# Altium schematic sheet uSD Card Interface.SchDoc: uSD Card Connection Port
size A4
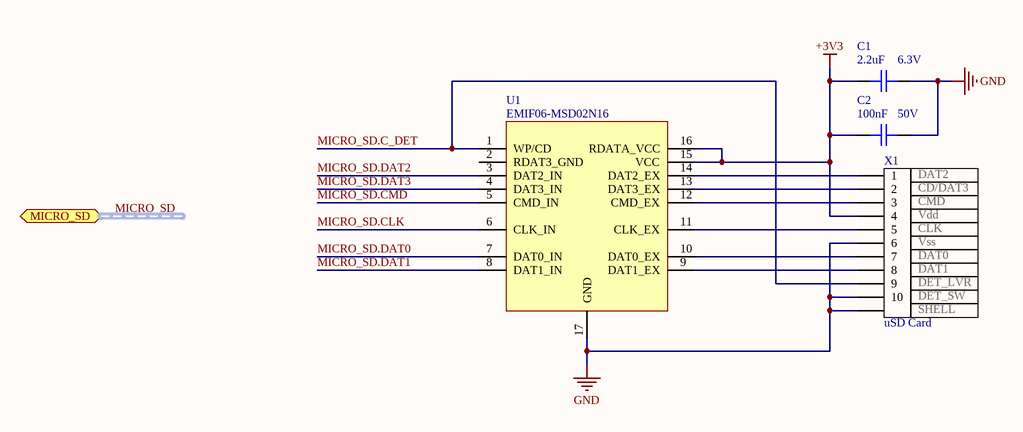
[diagram p0: uSD Card Interface.SchDoc]

## Parts
C1  Capacitance: 2.2uF  Voltage: 6.3V  [C0402]  (hidden comment: CAP CER 2.2UF 6.3V X5R 0402)
C2  Capacitance: 100nF  Voltage: 50V  [C0402]  (hidden comment: CAP CER 0.1UF 50V X7R 0402)
U1  EMIF06-MSD02N16  [QFN 3.5x1.2-16L]
X1  uSD Card  pin_1: DAT2  pin_2: CD/DAT3  pin_3: CMD  pin_4: Vdd  pin_5: CLK  pin_6: Vss  pin_7: DAT0  pin_8: DAT1  pin_9: DET_LVR  pin_10: DET_SW  pin_0: SHELL  [5025700893]

## Ports
MICRO_SD (harness MICRO_SD)

## Nets
+3V3: C1.2 C2.2 U1.15(VCC) U1.16(RDATA_VCC) X1.4
GND: C1.1 C2.1 U1.17(GND) X1.0 X1.6 X1.10
MICRO_SD.C_DET: U1.1(WP/CD) X1.9
MICRO_SD.CLK: U1.6(CLK_IN)
MICRO_SD.CMD: U1.5(CMD_IN)
MICRO_SD.DAT0: U1.7(DAT0_IN)
MICRO_SD.DAT1: U1.8(DAT1_IN)
MICRO_SD.DAT2: U1.3(DAT2_IN)
MICRO_SD.DAT3: U1.4(DAT3_IN)
NetU1_9: U1.9(DAT1_EX) X1.8
NetU1_10: U1.10(DAT0_EX) X1.7
NetU1_11: U1.11(CLK_EX) X1.5
NetU1_12: U1.12(CMD_EX) X1.3
NetU1_13: U1.13(DAT3_EX) X1.2
NetU1_14: U1.14(DAT2_EX) X1.1

Not connected (* = marked no-connect by the designer): U1 2(RDAT3_GND)

## Buses and harness runs
harness MICRO_SD = port MICRO_SD

## Notes on the sheet
- Title
- Size:
- Date:
- A4
- Number:
- Time:
- Revision:
- Sheet
- of
- File:

## Library data of the parts
C1 = CAP CER 2.2UF 6.3V X5R 0402: 2.2µF ±20% 6.3V Ceramic Capacitor X5R 0402 (1005 Metric); Manufacturer: Murata; Manufacturer Part Number: GRM155R60J225ME15D; Supplier 1: Digi-Key; Stock 1: 4444410; Pricing 1: 1=0.29, 10=0.199, 100=0.1009, 500=0.0691, 1000=0.0611, 2500=0.0584, 5000=0.0531 (USD); Mount: Surface Mount; Case/Package: 0402; Case Code (Metric): 1005; Material: Ceramic; Min Operating Temperature: -55°C; Max Operating Temperature: 85°C; Tolerance: 20%; Dielectric: X5R; Packaging: Tape and Reel; Package Quantity: 10000; Voltage Rating: 6.3V; Voltage Rating (DC): 6.3V; Termination: SMD/SMT; Length: 1mm; Height: 0.5mm; Width: 0.02inch; Thickness: 0.022inch; Depth: 0.5mm; Radiation Hardening: No; REACH SVHC: No SVHC; Lead Free: Lead Free; ComponentLink1URL: https://www.murata.com/~/media/webrenewal/support/library/catalog/products/capacitor/mlcc/c02e.ashx?la=en-us&src-supplier=Digi-Key; ComponentLink1Description: https://www.murata.com/~/media/webrenewal/support/library/catalog/products/capacitor/mlcc/c02e.ashx?la=en-us&src-supplier=Digi-Key; ComponentLink2URL: http://www.murata.com/~/media/webrenewal/support/library/catalog/products/capacitor/mlcc/c02e.ashx?src-supplier=Avnet; ComponentLink2Description: http://www.murata.com/~/media/webrenewal/support/library/catalog/products/capacitor/mlcc/c02e.ashx?src-supplier=Avnet; ComponentLink3URL: http://www.farnell.com/datasheets/2047859.pdf?src-supplier=Element14; ComponentLink3Description: http://www.farnell.com/datasheets/2047859.pdf?src-supplier=Element14; ComponentLink4URL: https://produktinfo.conrad.com/datenblaetter/450000-474999/450128-da-01-de-VS_KONDENS_GRM155_R60J_225ME15D.pdf?src-supplier=Conrad; ComponentLink4Description: https://produktinfo.conrad.com/datenblaetter/450000-474999/450128-da-01-de-VS_KONDENS_GRM155_R60J_225ME15D.pdf?src-supplier=Conrad; Supplier Part Number 1: 490-4519-1-ND; Case Code (Imperial): 0402
C2 = CAP CER 0.1UF 50V X7R 0402: 0.1µF ±10% 50V Ceramic Capacitor X7R 0402 (1005 Metric); Manufacturer: TDK; Manufacturer Part Number: CGA2B3X7R1H104K050BB; Supplier 1: Digi-Key; Stock 1: 2925303; Pricing 1: 1=0.17, 10=0.118, 50=0.0668, 100=0.0553, 500=0.0388, 1000=0.0321, 2500=0.0299, 5000=0.0273 (USD); Mount: Surface Mount; Case/Package: 0402; Weight: 2.3E-05oz; Case Code (Metric): 1005; Case Code (Imperial): 0402; Min Operating Temperature: -55°C; Max Operating Temperature: 125°C; Voltage Rating: 50V; Tolerance: 10%; Packaging: Tape and Reel; Package Quantity: 1; Voltage Rating (DC): 50V; Dielectric: X7R; Termination: SMD/SMT; Composition: Ceramic; Length: 1mm; Height: 0.5mm; Width: 0.02inch; Thickness: 0.022inch; Depth: 0.5mm; Ratings: AEC-Q200; REACH SVHC: No SVHC; Lead Free: Lead Free; ComponentLink1URL: http://product.tdk.com/capacitor/mlcc/en/documents/mlccspec_automotive_general_midvoltage_en.pdf?src-supplier=Future+Electronics; ComponentLink1Description: http://product.tdk.com/capacitor/mlcc/en/documents/mlccspec_automotive_general_midvoltage_en.pdf?src-supplier=Future+Electronics; ComponentLink2URL: http://www.farnell.com/datasheets/1807242.pdf?src-supplier=Element14; ComponentLink2Description: http://www.farnell.com/datasheets/1807242.pdf?src-supplier=Element14; ComponentLink3URL: http://www.mouser.com/ds/2/400/lcc_automotive_general_en-843974.pdf?src-supplier=Mouser; ComponentLink3Description: http://www.mouser.com/ds/2/400/lcc_automotive_general_en-843974.pdf?src-supplier=Mouser; ComponentLink4URL: http://www.farnell.com/datasheets/1936565.pdf?src-supplier=Element14; ComponentLink4Description: http://www.farnell.com/datasheets/1936565.pdf?src-supplier=Element14; ComponentLink5URL: http://www.farnell.com/datasheets/1735392.pdf?src-supplier=Element14; ComponentLink5Description: http://www.farnell.com/datasheets/1735392.pdf?src-supplier=Element14; Supplier Part Number 1: 445-6899-1-ND
U1 = FILTER RC(PI) 45 OHM/20PF SMD: RC (Pi) EMI Filter 2nd Order Low Pass 6 Channel R = 45Ohms, C = 20pF (Total)  16-UFDFN Exposed Pad; Manufacturer: STMicroelectronics; Number of Channels: 6; ESD Protection: Yes; Breakdown Voltage: 8V; Supplier 1: Digi-Key; Manufacturer Part Number: EMIF06-MSD02N16; Stock 1: 3881; Pricing 1: 1=0.95, 10=0.904, 25=0.8752, 50=0.7148, 100=0.6418, 250=0.5834, 500=0.5543, 1000=0.4959 (USD); Mount: Surface Mount; Case/Package: QFN; Number of Pins: 16; Contact Plating: Gold; Min Operating Temperature: -30°C; Max Operating Temperature: 85°C; Termination: Flat; Packaging: Tape and Reel; Package Quantity: 1; Capacitance: 20pF; Max Breakdown Voltage: 8V; Length: 3.55mm; Height: 0.022inch; Width: 0.047inch; Depth: 1.25mm; Radiation Hardening: No; Lead Free: Lead Free; REACH SVHC: No SVHC; ComponentLink1URL: http://www.st.com/content/ccc/resource/technical/document/datasheet/a7/86/d3/98/2c/7f/4b/d2/CD00217829.pdf/files/CD00217829.pdf/jcr:content/translations/en.CD00217829.pdf?src-supplier=Digi-Key; ComponentLink1Description: http://www.st.com/content/ccc/resource/technical/document/datasheet/a7/86/d3/98/2c/7f/4b/d2/CD00217829.pdf/files/CD00217829.pdf/jcr:content/translations/en.CD00217829.pdf?src-supplier=Digi-Key; ComponentLink2URL: https://www.verical.com/server-webapp/html/getDatasheet?partID=558558&src-supplier=Verical; ComponentLink2Description: https://www.verical.com/server-webapp/html/getDatasheet?partID=558558&src-supplier=Verical; ComponentLink3URL: http://www.st.com/web/en/resource/technical/document/datasheet/CD00217829.pdf?src-supplier=Mouser; ComponentLink3Description: http://www.st.com/web/en/resource/technical/document/datasheet/CD00217829.pdf?src-supplier=Mouser; Supplier Part Number 1: 497-8751-1-ND
X1 = CONN MICRO SD CARD PUSH-PUSH R/A: 10 (8 + 2) Position Card Connector Secure Digital - microSD™ Surface Mount, Right Angle Gold; Manufacturer: Molex; Current Rating: 500mA; Voltage Rating (AC): 10V; Max Voltage Rating (DC): 1.01kV; Gender: Female; Number of Contacts: 8; Pitch: 1.1mm; Supplier 1: Digi-Key; Manufacturer Part Number: 5025700893; Stock 1: 10664; Pricing 1: 1=3.97, 10=3.812, 25=3.4944, 50=3.3356, 100=3.1768, 250=2.7797, 500=2.7003 (USD); Mount: Surface Mount; Contact Material: Copper Alloy,Copper; Contact Plating: Gold; Housing Material: Polymer; Min Operating Temperature: -25°C; Max Operating Temperature: 85°C; Packaging: Tape and Reel; Number of Rows: 1; Package Quantity: 1; Connector Type: Connector; Termination: SMD/SMT; Orientation: Right Angle; Number of Circuits: 8; Length: 13.8mm; Height: 1.8mm; Width: 1.8mm; Depth: 15.5mm; Radiation Hardening: No; REACH SVHC: Unknown; Halogen Free: Low Halogen; Lead Free: Lead Free; ComponentLink1URL: https://www.molex.com/pdm_docs/sd/5025700893_sd.pdf?src-supplier=Digi-Key; ComponentLink1Description: https://www.molex.com/pdm_docs/sd/5025700893_sd.pdf?src-supplier=Digi-Key; ComponentLink2URL: http://www.mouser.com/ds/2/276/5025700893_MEMORY_CARD_SOCKET-179363.pdf?src-supplier=Mouser; ComponentLink2Description: http://www.mouser.com/ds/2/276/5025700893_MEMORY_CARD_SOCKET-179363.pdf?src-supplier=Mouser; ComponentLink3URL: http://www.molex.com/webdocs/datasheets/pdf/en-us/5025700893_MEMORY_CARD_SOCKET.pdf?src-supplier=Avnet+Europe; ComponentLink3Description: http://www.molex.com/webdocs/datasheets/pdf/en-us/5025700893_MEMORY_CARD_SOCKET.pdf?src-supplier=Avnet+Europe; ComponentLink4URL: http://www.farnell.com/datasheets/1630840.pdf?src-supplier=Element14; ComponentLink4Description: http://www.farnell.com/datasheets/1630840.pdf?src-supplier=Element14; ComponentLink5URL: http://uk.rs-online.com/webdocs/13c5/0900766b813c54fb.pdf?src-supplier=RSComponents; ComponentLink5Description: http://uk.rs-online.com/webdocs/13c5/0900766b813c54fb.pdf?src-supplier=RSComponents; ComponentLink6URL: https://www.verical.com/server-webapp/html/getDatasheet?partID=321553&src-supplier=Verical; ComponentLink6Description: https://www.verical.com/server-webapp/html/getDatasheet?partID=321553&src-supplier=Verical; ComponentLink7URL: http://www.molex.com/webdocs/datasheets/pdf/en-us/5025700893_MEMORY_CARD_SOCKET.pdf?src-supplier=Avnet+Asia; ComponentLink7Description: http://www.molex.com/webdocs/datasheets/pdf/en-us/5025700893_MEMORY_CARD_SOCKET.pdf?src-supplier=Avnet+Asia; ComponentLink8URL: http://www.molex.com/webdocs/datasheets/pdf/en-us/5025700893_MEMORY_CARD_SOCKET.pdf?src-supplier=Avnet; ComponentLink8Description: http://www.molex.com/webdocs/datasheets/pdf/en-us/5025700893_MEMORY_CARD_SOCKET.pdf?src-supplier=Avnet; ComponentLink9URL: http://www.molex.com/webdocs/datasheets/pdf/en-us/5025700893_MEMORY_CARD_SOCKET.pdf?src-supplier=Element14; ComponentLink9Description: http://www.molex.com/webdocs/datasheets/pdf/en-us/5025700893_MEMORY_CARD_SOCKET.pdf?src-supplier=Element14; Supplier Part Number 1: WM19093CT-ND